# EasyEDA Pro project Laser Monitor.eprj, board Main Board PCB
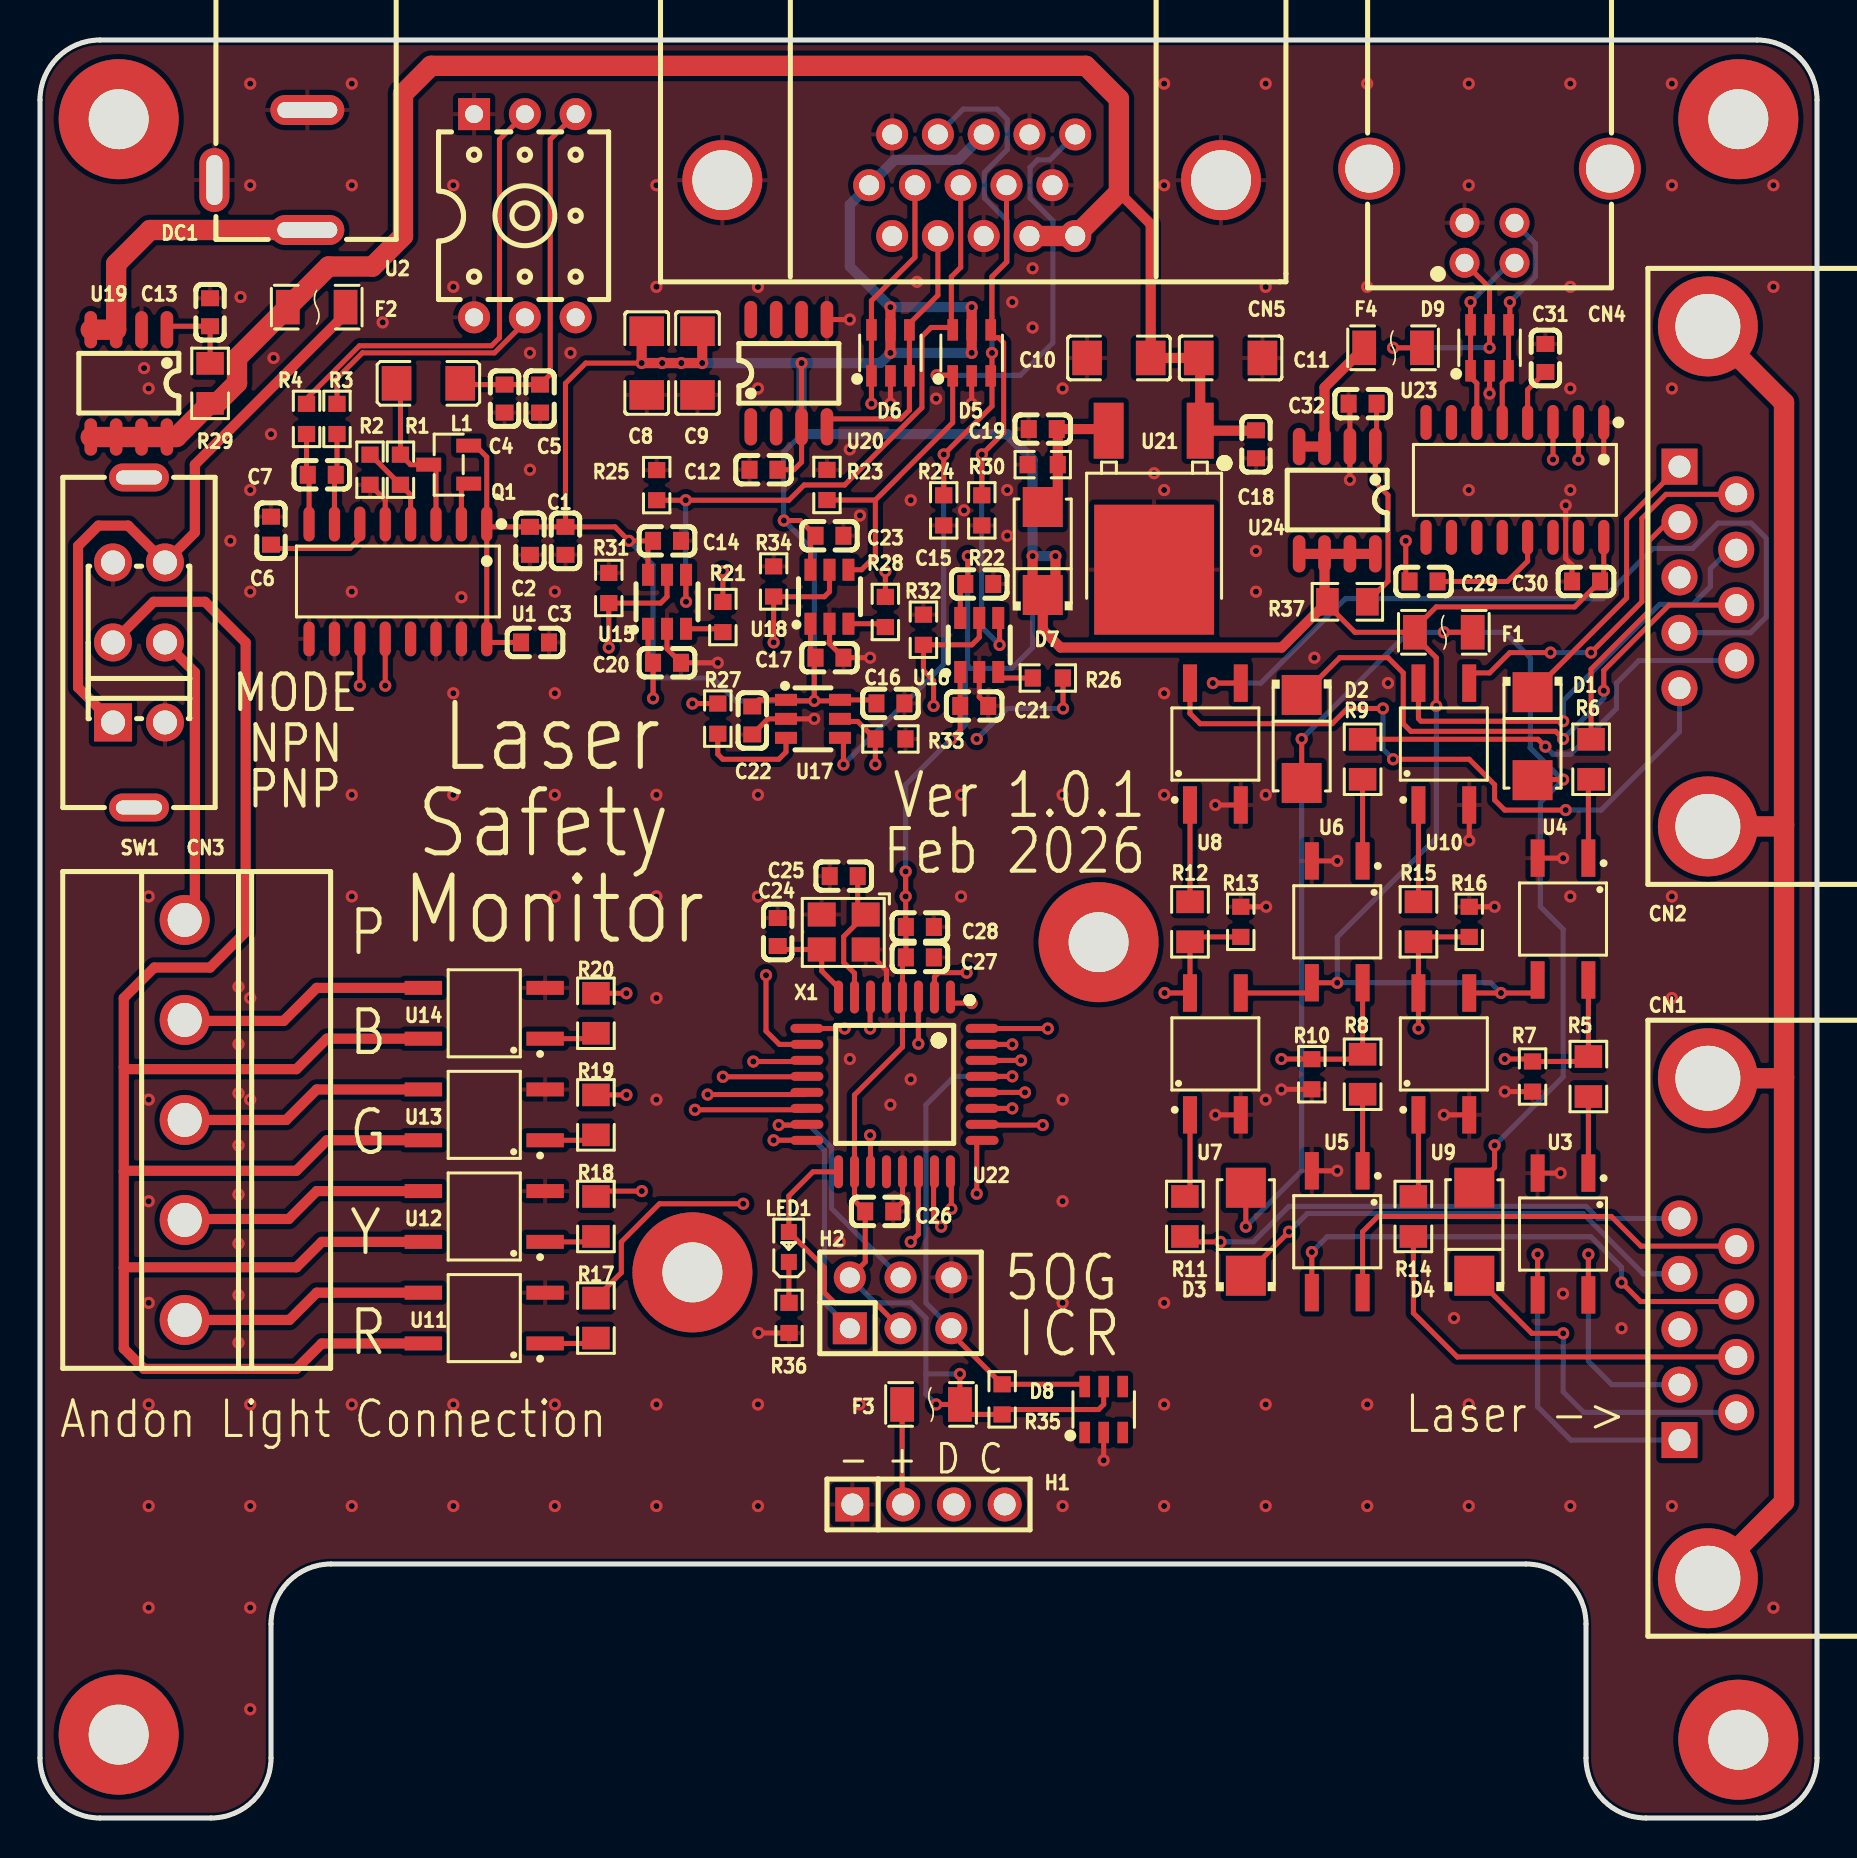
[diagram p6: board, top side]
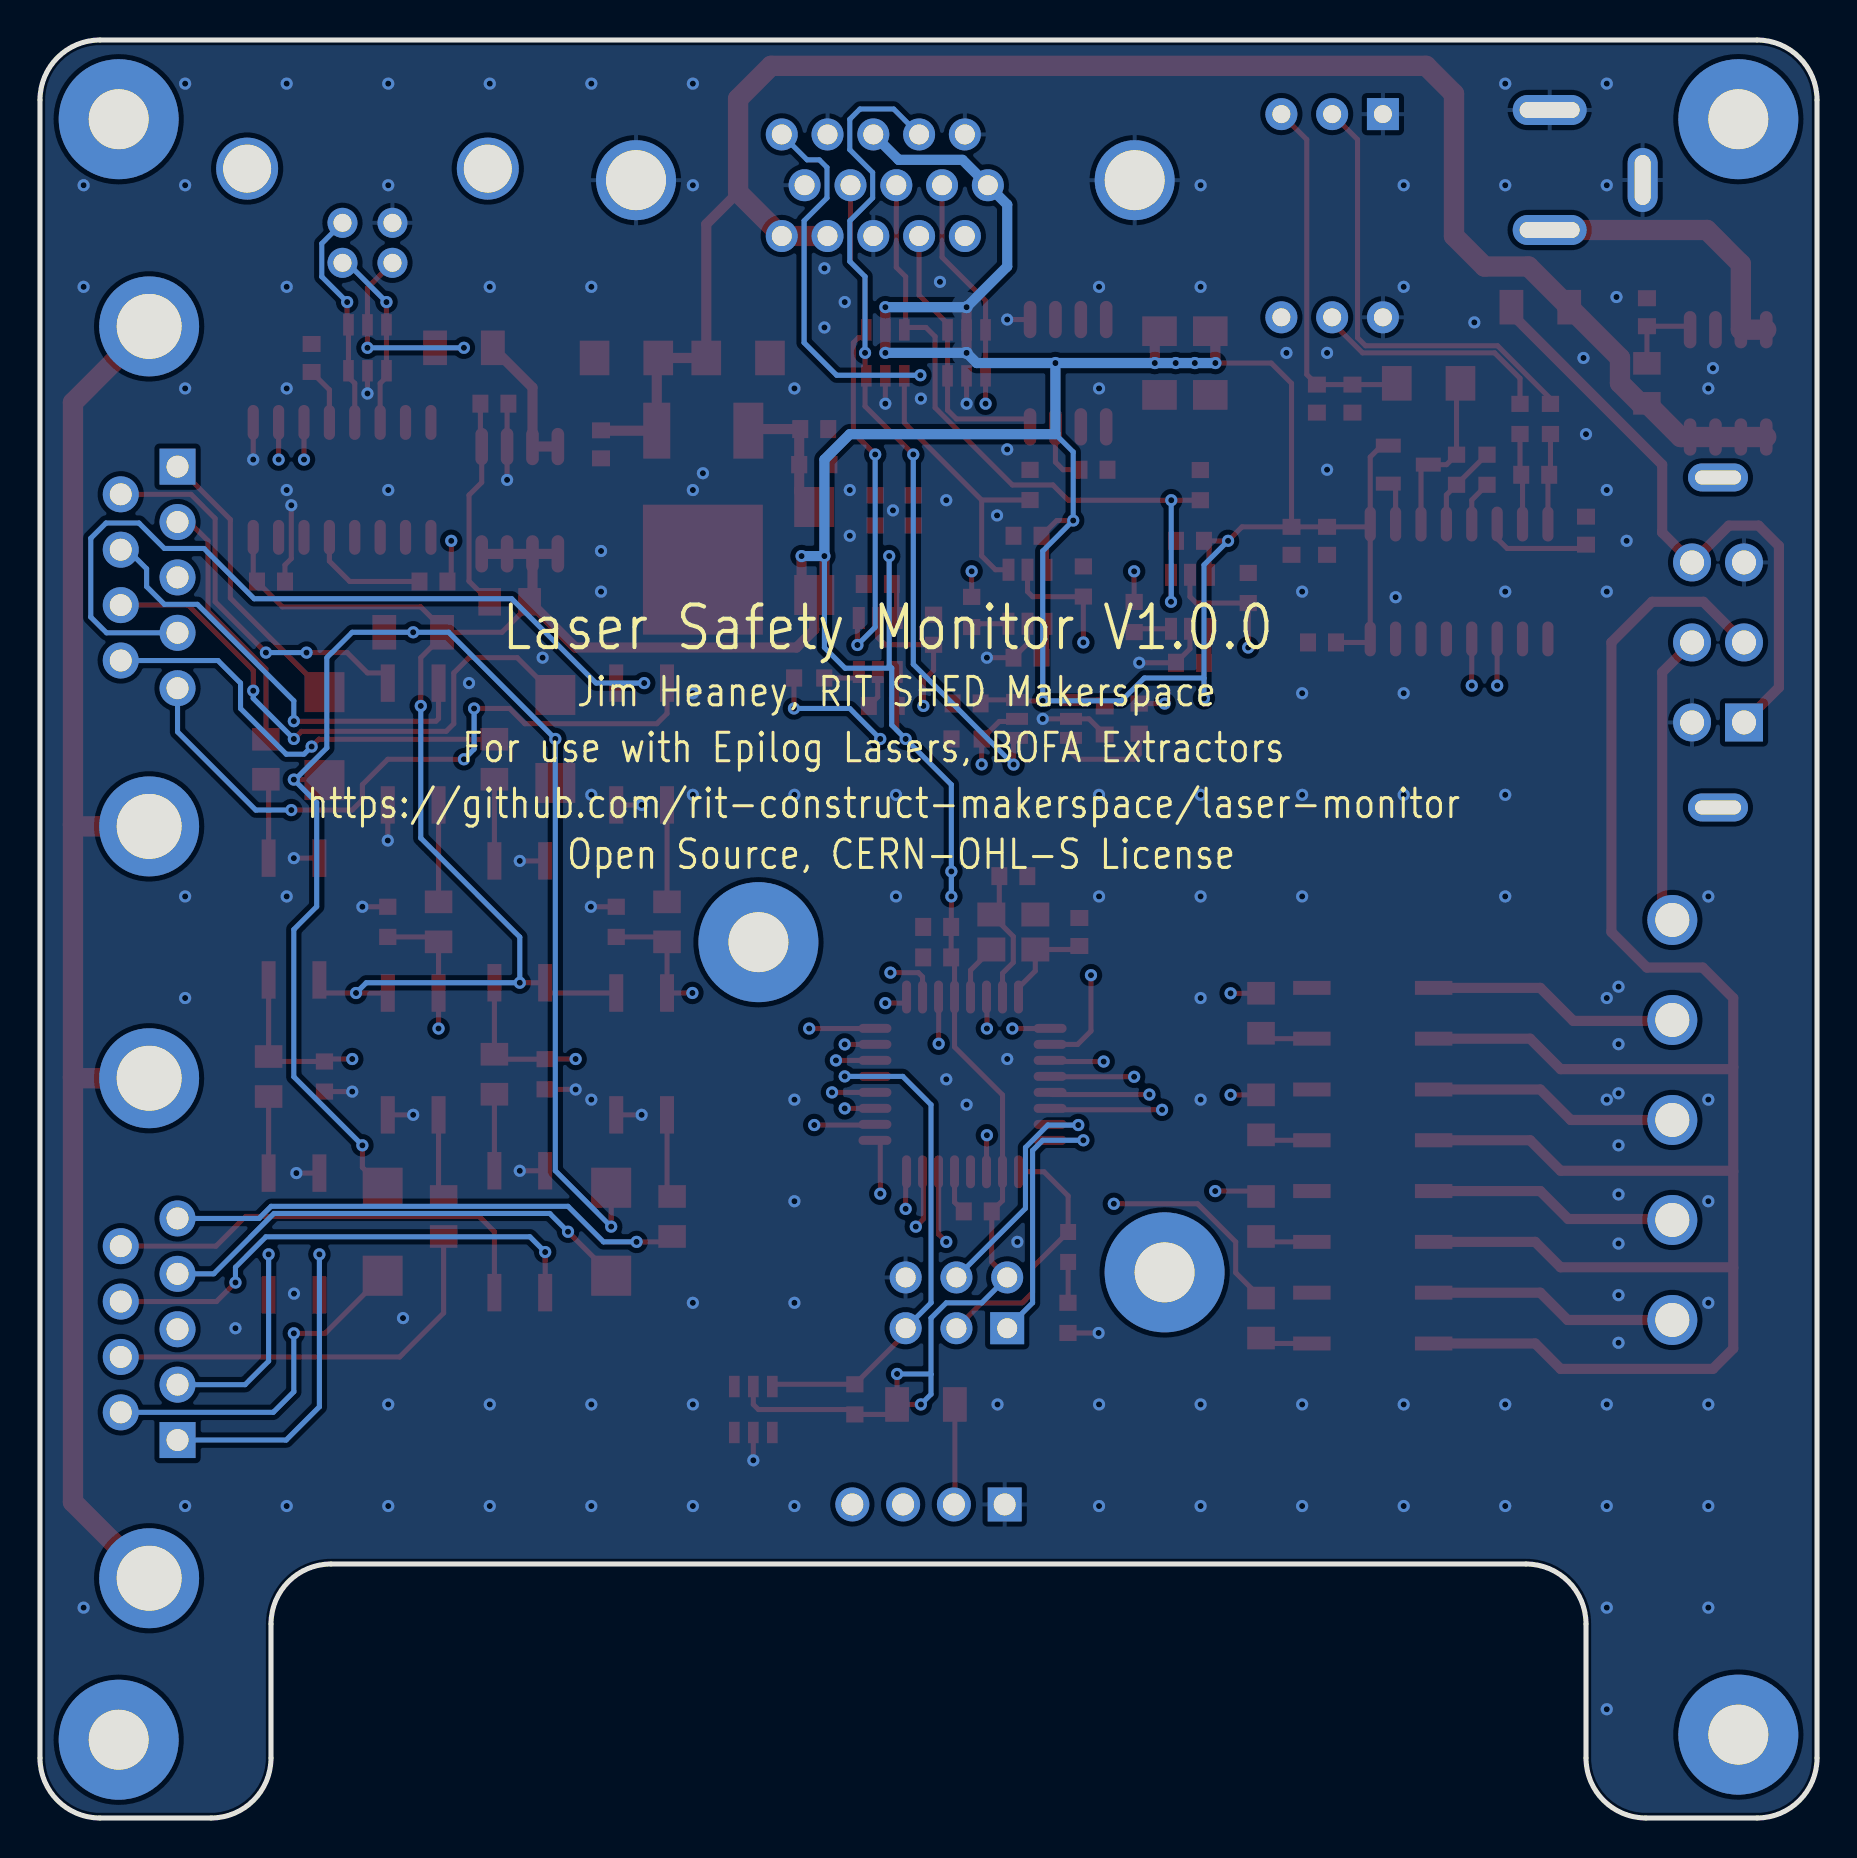
[diagram p7: board, bottom side, seen from below]

Outline 88.9 x 88.9 mm; copper layers: Top Layer, Inner1, Inner2, Bottom Layer. Coordinates in mm from the lower left corner of the outline.
Outline path: 0,85.9 arc(0.88,88.02) 3,88.9 85.9,88.9 arc(88.02,88.02) 88.9,85.9 88.9,3 arc(88.02,0.88) 85.9,0 80.34,0 arc(78.22,0.88) 77.34,3 77.34,9.7 arc(76.46,11.82) 74.34,12.7 14.56,12.7 arc(12.44,11.82) 11.56,9.7 11.56,3 arc(10.68,0.88) 8.56,0 3,0 arc(0.88,0.88) 0,3 0,85.9
Stack: Top Layer 0.035mm Outer layer thickness 1oz / Dielectric1 0.2104mm 7628 RC49% 8.6mil / Inner1 0.0152mm Inner layer thickness / Dielectric2 1.065mm 1.1mm H/HOZ Copper / Inner2 0.0152mm Inner layer thickness / Dielectric3 0.2104mm 7628 RC49% 8.6mil / Bottom Layer 0.035mm Outer layer thickness 1oz

## Design rules (mm)
template: JLCPCB Capability(Two Layers Board)
spacing copperThickness1oz (default): track to track 0.102, other pairs 0.152 to 0.3
spacing copperThickness2oz: track to track 0.203, other pairs 0.152 to 0.3
track width copperThickness1oz (default): min 0.127, default 0.254, max 2.54
track width copperThickness2oz: min 0.203, default 0.254, max 2.54
differential pair differentialPair (default): width min 0.127, default 0.254, max 2.54; gap min 0.152, default 0.152
via viaSize (default): diameter min 0.5, default 0.61, max 10; hole min 0.3, default 0.305, max 6.3

## Placement (name value [footprint] x y rotation side)
C1  10uF  [C0603]  26.29 63.86 90 top
C2  100nF  [C0603]  24.51 63.86 90 top
C3  100nF  [C0603]  24.77 58.78 180 top
C4  100nF  [C0603]  23.24 70.97 90 top
C5  10uF  [C0603]  25.02 70.97 90 top
C6  100nF  [C0603]  11.56 64.37 270 top
C7  100nF  [C0603]  14.1 67.16 0 top
C8  22uF  [C1206]  30.35 72.75 90 top
C9  22uF  [C1206]  32.89 72.75 90 top
C10  22uF  [C1206]  53.98 73 0 top
C11  22uF  [C1206]  59.56 73 180 top
C12  100nF  [C0603]  36.2 67.41 0 top
C13  100nF  [C0603]  8.51 75.29 270 top
C14  100nF  [C0603]  31.37 63.86 180 top
C15  100nF  [C0603]  46.99 61.7 180 top
C16  100nF  [C0603]  42.55 55.73 180 top
C17  100nF  [C0603]  39.5 58.02 180 top
C18  1uF  [C0603]  60.83 68.68 90 top
C19  1uF  [C0603]  50.17 69.45 0 top
C20  100nF  [C0603]  31.37 57.76 180 top
C21  100nF  [C0603]  46.74 55.6 180 top
C22  100nF  [C0603]  35.64 54.88 90 top
C23  100nF  [C0603]  39.5 64.11 180 top
C24  15pF  [C0603]  36.91 44.3 270 top
C25  15pF  [C0603]  40.21 47.09 0 top
C26  100nF  [C0603]  41.99 30.33 180 top
C27  100nF  [C0603]  44.02 43.03 180 top
C28  1uF  [C0603]  44.02 44.55 180 top
C29  100nF  [C0603]  69.21 61.83 0 top
C30  100nF  [C0603]  77.34 61.83 0 top
C31  100nF  [C0603]  75.31 73 270 top
C32  100nF  [C0603]  66.17 70.72 0 top
CN1  DR-9M  [DR9-TH_ZHOUR_DR-9P-R]  83.44 24.49 90 top
CN2  DR-9F  [DR9-TH_ZHOUR_DR-9P-L]  83.44 62.08 90 top
CN3  DB103-5.0-5P-BU-S  [CONN-TH_5P-P5.00_DB103-5.0-5P-BU-S]  7.24 34.9 90 top
CN4  921-111A1010D10200  [USB-B_TH_USB-B-FEMALE-90]  72.52 80.11 180 top
CN5  DS1038-15FBNSiA74-0CC  [DSUB-TH_DS1038-15FBNSIA74-0CC]  46.61 81.64 180 top
D1  SS34  [SMA_L4.3-W2.6-LS5.2-RD]  74.67 54.09 270 top
D2  SS34  [SMA_L4.3-W2.6-LS5.2-RD]  63.12 53.95 270 top
D3  SS34  [SMA_L4.3-W2.6-LS5.2-RD]  60.33 29.31 90 top
D4  SS34  [SMA_L4.3-W2.6-LS5.2-RD]  71.76 29.31 90 top
D5  SRV05-4  [SOT-23-6_L2.9-W1.6-P0.95-LS2.8-BL]  46.61 73.26 0 top
D6  SRV05-4  [SOT-23-6_L2.9-W1.6-P0.95-LS2.8-BL]  42.55 73.26 0 top
D7  SS34  [SMA_L4.3-W2.6-LS5.2-RD]  50.17 63.35 90 top
D8  SRV05-4  [SOT-23-6_L2.9-W1.6-P0.95-LS2.8-BL]  53.21 20.42 0 top
D9  SRV05-4  [SOT-23-6_L2.9-W1.6-P0.95-LS2.8-BL]  72.52 73.51 0 top
DC1  DC-005-A250  [DC-IN-TH_DC-005-A250]  11.05 82.4 270 top
F1  MF-NSMF050-2  [F1206]  70.23 59.29 180 top
F2  MF-NSMF050-2  [F1206]  13.84 75.54 0 top
F3  MF-NSMF050-2  [F1206]  44.58 20.68 0 top
F4  MF-NSMF050-2  [F1206]  67.69 73.51 0 top
H1  -  [HDR-TH_4P-P2.54-V-M]  44.45 15.68 0 top
H2  -  [HDR-TH_6P-P2.54-V-F-R2-C3-S2.54]  43.05 25.76 0 top
L1  10uH  [L1206]  19.43 71.73 180 top
LED1  KT-0603R  [LED0603-RD]  37.46 28.55 90 top
NOREF  -  [Pad_e1474]  32.64 27.28 0 top
NOREF#2  -  [Pad_e123]  84.96 3.91 0 top
NOREF#3  -  [Pad_e121]  84.96 84.94 0 top
NOREF#4  -  [Pad_e124]  3.94 4.17 0 top
NOREF#5  -  [Pad_e1475]  52.96 43.79 0 top
NOREF#6  -  [Pad_e125]  3.94 84.94 0 top
Q1  MMBT4403  [SOT-23-3_L2.9-W1.3-P0.95-LS2.4-BR]  20.45 67.67 0 top
R1  20kΩ  [R0603]  18.03 67.41 90 top
R2  8.2kΩ  [R0603]  16.51 67.41 90 top
R3  100Ω  [R0603]  14.86 69.95 90 top
R4  100Ω  [R0603]  13.34 69.95 90 top
R5  390Ω  [R0805]  77.46 37.07 90 top
R6  390Ω  [R0805]  77.6 52.94 270 top
R7  10kΩ  [R0603]  74.67 37.07 90 top
R8  390Ω  [R0805]  66.17 37.19 90 top
R9  390Ω  [R0805]  66.17 52.94 270 top
R10  10kΩ  [R0603]  63.63 37.19 90 top
R11  390Ω  [R0805]  57.28 30.08 270 top
R12  390Ω  [R0805]  57.53 44.81 270 top
R13  10kΩ  [R0603]  60.07 44.81 270 top
R14  390Ω  [R0805]  68.71 30.08 270 top
R15  390Ω  [R0805]  68.96 44.81 270 top
R16  10kΩ  [R0603]  71.5 44.81 270 top
R17  390Ω  [R0805]  27.81 25 90 top
R18  390Ω  [R0805]  27.81 30.08 90 top
R19  390Ω  [R0805]  27.81 35.16 90 top
R20  390Ω  [R0805]  27.81 40.24 90 top
R21  4.7kΩ  [R0603]  34.16 60.05 90 top
R22  10kΩ  [R0603]  47.12 65.38 270 top
R23  10kΩ  [R0603]  39.37 66.65 90 top
R24  10kΩ  [R0603]  45.21 65.38 270 top
R25  10kΩ  [R0603]  30.85 66.64 90 top
R26  4.7kΩ  [R0603]  50.42 57 0 top
R27  4.7kΩ  [R0603]  33.91 54.97 90 top
R28  4.7kΩ  [R0603]  42.29 60.3 90 top
R29  390Ω  [R0805]  8.51 71.73 270 top
R30  1kΩ  [R0603]  50.17 67.67 0 top
R31  10kΩ  [R0603]  28.46 61.5 90 top
R32  10kΩ  [R0603]  44.2 59.41 90 top
R33  10kΩ  [R0603]  42.55 53.95 0 top
R34  10kΩ  [R0603]  36.7 61.83 90 top
R35  10kΩ  [R0603]  48.13 20.93 270 top
R36  1kΩ  [R0603]  37.47 25 90 top
R37  390Ω  [R0805]  65.41 60.81 180 top
SW1  SS-22F07-G100  [SW-TH_6P-L16.5-W7.5-P4.0-LS2.6-TL]  4.95 58.78 90 top
U1  HX711  [SOP-16_L10.0-W3.9-P1.27-LS6.0-BL]  17.91 61.83 180 top
U2  WF100SPZ 2BG D6 AT  [DIP-6_L8.5-W8.5-P2.54-LS10.2-TL]  24.26 80.11 0 top
U3  AT172-CuH-S  [SOP-4_L4.6-W4.2-P2.54-LS7.1-BL]  76.19 29.2 180 top
U4  AT172-CuH-S  [SOP-4_L4.6-W4.2-P2.54-LS7.1-BL]  76.19 44.95 180 top
U5  AT172-CuH-S  [SOP-4_L4.6-W4.2-P2.54-LS7.1-BL]  64.9 29.31 180 top
U6  AT172-CuH-S  [SOP-4_L4.6-W4.2-P2.54-LS7.1-BL]  64.9 44.81 180 top
U7  AT172-CuH-S  [SOP-4_L4.6-W4.2-P2.54-LS7.1-BL]  58.8 38.2 0 top
U8  AT172-CuH-S  [SOP-4_L4.6-W4.2-P2.54-LS7.1-BL]  58.8 53.7 0 top
U9  AT172-CuH-S  [SOP-4_L4.6-W4.2-P2.54-LS7.1-BL]  70.23 38.2 0 top
U10  AT172-CuH-S  [SOP-4_L4.6-W4.2-P2.54-LS7.1-BL]  70.23 53.7 0 top
U11  AT172-CuH-S  [SOP-4_L4.6-W4.2-P2.54-LS7.1-BL]  22.23 25 90 top
U12  AT172-CuH-S  [SOP-4_L4.6-W4.2-P2.54-LS7.1-BL]  22.23 30.08 90 top
U13  AT172-CuH-S  [SOP-4_L4.6-W4.2-P2.54-LS7.1-BL]  22.23 35.16 90 top
U14  AT172-CuH-S  [SOP-4_L4.6-W4.2-P2.54-LS7.1-BL]  22.23 40.24 90 top
U15  SN74LVC1T45DBVR  [SOT-23-6_L2.9-W1.6-P0.95-LS2.8-BR]  31.37 60.81 270 top
U16  SN74LVC1T45DBVR  [SOT-23-6_L2.9-W1.6-P0.95-LS2.8-BR]  46.99 58.65 270 top
U17  SN74LVC1T45DBVR  [SOT-23-6_L2.9-W1.6-P0.95-LS2.8-BR]  38.67 54.96 180 top
U18  SN74LVC1T45DBVR  [SOT-23-6_L2.9-W1.6-P0.95-LS2.8-BR]  39.5 61.06 270 top
U19  MX5052S  [SOP-8_L4.9-W3.9-P1.27-LS6.0-BL]  4.45 71.73 180 top
U20  DS18B20Z  [SOP-8_L4.9-W3.9-P1.27-LS6.0-BL]  37.46 72.24 0 top
U21  L78M05ABDT-TR  [TO-252-2_L6.5-W6.1-P4.58-LS10.0-TL]  55.75 65.89 270 top
U22  ATMEGA328PB-AU  [TQFP-32_L7.0-W7.0-P0.80-LS9.0-BL]  42.75 36.68 180 top
U23  CH340C  [SOP-16_L10.0-W3.9-P1.27-LS6.0-BL]  73.79 66.91 180 top
U24  MX5052S  [SOP-8_L4.9-W3.9-P1.27-LS6.0-BL]  64.9 65.89 180 top
X1  16MHz  [OSC-SMD_4P-L3.2-W2.5-BL]  40.21 44.3 180 top

## Footprints (pads in the part's own frame, mm; a bottom-side part is the same pattern mirrored in y, then rotated)
C0603
  rect 0.8x0.9 smd: 1(-0.7,0) 2(0.7,0)
C1206
  rect 1.485x1.728 smd: 1(-1.593,0) 2(1.593,0)
CONN-TH_5P-P5.00_DB103-5.0-5P-BU-S
  round 2.5 hole 1.7: 1(-10,0) 2(-5,0) 3(0,0) 4(5,0) 5(10,0)
DC-IN-TH_DC-005-A250
  oval 1.5x3.7 hole 0.8x3: 1(3,2.325) 2(-3,2.325)
  oval 3.2x1.5 hole 2.5x0.8: 3(0.5,-2.325)
DIP-6_L8.5-W8.5-P2.54-LS10.2-TL
  rect 1.6x1.6 hole 0.9: 1(-2.54,5.08)
  round 1.6 hole 0.9: 2(0,5.08) 3(2.54,5.08) 4(2.54,-5.08) 5(0,-5.08) 6(-2.54,-5.08)
DR9-TH_ZHOUR_DR-9P-L
  rect 1.8x1.8 hole 1.1: 1(5.489,1.42)
  round 1.8 hole 1.1: 2(2.719,1.42) 3(-0.051,1.42) 4(-2.821,1.42) 5(-5.59,1.42) 6(4.104,-1.42) 7(1.335,-1.42) 8(-1.435,-1.42) 9(-4.205,-1.42)
  round 5 hole 3.25: 10(-12.5,0) 11(12.5,0)
DR9-TH_ZHOUR_DR-9P-R
  rect 1.8x1.8 hole 1.1: 1(-5.59,1.42)
  round 1.8 hole 1.1: 2(-2.821,1.42) 3(-0.051,1.42) 4(2.72,1.42) 5(5.489,1.42) 6(-4.206,-1.42) 7(-1.435,-1.42) 8(1.334,-1.42) 9(4.104,-1.42)
  round 5 hole 3.25: 10(-12.5,0) 11(12.5,0)
DSUB-TH_DS1038-15FBNSIA74-0CC
  round 1.6 hole 1: 1(3.978,2.54) 2(1.688,2.54) 3(-0.603,2.54) 4(-2.893,2.54) 5(-5.182,2.54) 6(5.128,0) 7(2.837,0) 8(0.548,0) 9(-1.743,0) 10(-4.042,0) 11(3.978,-2.54) 12(1.688,-2.54) 13(-0.603,-2.54) 14(-2.893,-2.54) 15(-5.182,-2.54)
  round 4 hole 3: 16(12.473,-0.254) 17(-12.473,-0.254)
F1206
  rect 1.19x1.728 smd: 1(-1.445,0) 2(1.445,0)
HDR-TH_4P-P2.54-V-M
  rect 1.7x1.7 hole 1.1: 1(-3.81,0)
  round 1.7 hole 1.1: 2(-1.27,0) 3(1.27,0) 4(3.81,0)
HDR-TH_6P-P2.54-V-F-R2-C3-S2.54
  rect 1.7x1.6 hole 1: 1(-2.54,-1.27)
  round 1.6 hole 1: 2(-2.54,1.27) 3(0,-1.27) 4(0,1.27) 5(2.54,-1.27) 6(2.54,1.27)
L1206
  rect 1.485x1.728 smd: 1(-1.593,0) 2(1.593,0)
LED0603-RD
  rect 0.8x0.8 smd: 1(-0.749,0) 2(0.749,0)
OSC-SMD_4P-L3.2-W2.5-BL
  rect 1.4x1.2 smd: 1(-1.1,-0.875) 2(1.1,-0.875) 3(1.1,0.875) 4(-1.1,0.875)
Pad_e121
  round 6 hole 3: 1(0,0)
Pad_e123
  round 6 hole 3: 1(0,0)
Pad_e124
  round 6 hole 3: 1(0,0)
Pad_e125
  round 6 hole 3: 1(0,0)
Pad_e1474
  round 6 hole 3: 1(0,0)
Pad_e1475
  round 6 hole 3: 1(0,0)
R0603
  rect 0.806x0.864 smd: 1(-0.753,0) 2(0.753,0)
R0805
  rect 1.133x1.377 smd: 1(-1,0) 2(1,0)
SMA_L4.3-W2.6-LS5.2-RD
  rect 2x2 smd: 1(-2.2,0) 2(2.2,0)
SOP-4_L4.6-W4.2-P2.54-LS7.1-BL
  rect 0.7x1.872 smd: 1(-1.27,-3.046) 2(1.27,-3.046) 3(1.27,3.046) 4(-1.27,3.046)
SOP-8_L4.9-W3.9-P1.27-LS6.0-BL
  oval 0.63x1.865 smd: 1(-1.905,-2.683) 2(-0.635,-2.683) 3(0.635,-2.683) 4(1.905,-2.683) 5(1.905,2.683) 6(0.635,2.683) 7(-0.635,2.683) 8(-1.905,2.683)
SOP-16_L10.0-W3.9-P1.27-LS6.0-BL
  oval 0.56x1.745 smd: 1(-4.445,-2.873) 2(-3.175,-2.873) 3(-1.905,-2.873) 4(-0.635,-2.873) 5(0.635,-2.873) 6(1.905,-2.873) 7(3.175,-2.873) 8(4.445,-2.873) 9(4.445,2.873) 10(3.175,2.873) 11(1.905,2.873) 12(0.635,2.873) 13(-0.635,2.873) 14(-1.905,2.873) 15(-3.175,2.873) 16(-4.445,2.873)
SOT-23-3_L2.9-W1.3-P0.95-LS2.4-BR
  rect 1.25x0.7 smd: 1(1,-0.95) 2(1,0.95) 3(-1,0)
SOT-23-6_L2.9-W1.6-P0.95-LS2.8-BL
  rect 0.532x1.072 smd: 1(-0.95,-1.149) 2(0,-1.149) 3(0.95,-1.149) 4(0.95,1.149) 5(0,1.149) 6(-0.95,1.149)
SOT-23-6_L2.9-W1.6-P0.95-LS2.8-BR
  rect 1.1x0.6 smd: 1(1.35,-0.95) 2(1.35,0) 3(1.35,0.95) 4(-1.35,0.95) 5(-1.35,0) 6(-1.35,-0.95)
SW-TH_6P-L16.5-W7.5-P4.0-LS2.6-TL
  rect 1.9x1.9 hole 1.2: 1(-4,1.3)
  round 1.9 hole 1.2: 2(0,1.3) 3(4,1.3) 4(-4,-1.3) 5(0,-1.3) 6(4,-1.3)
  oval 1.4x3 hole 0.7x2.3: 7(-8.25,0) 8(8.25,0)
TO-252-2_L6.5-W6.1-P4.58-LS10.0-TL
  rect 2.8x1.35 smd: 1(-3.475,2.29)
  rect 2.8x1.5 smd: 3(-3.475,-2.29)
  rect 6.5x6 smd: 4(3.475,-0.017)
TQFP-32_L7.0-W7.0-P0.80-LS9.0-BL
  oval 0.45x1.65 smd: 1(-2.8,-4.369) 2(-2,-4.369) 3(-1.2,-4.369) 4(-0.4,-4.369) 5(0.4,-4.369) 6(1.2,-4.369) 7(2,-4.369) 8(2.8,-4.369) 17(2.8,4.369) 18(2,4.369) 19(1.2,4.369) 20(0.4,4.369) 21(-0.4,4.369) 22(-1.2,4.369) 23(-2,4.369) 24(-2.8,4.369)
  oval 1.65x0.45 smd: 9(4.381,-2.8) 10(4.381,-2) 11(4.381,-1.2) 12(4.381,-0.4) 13(4.381,0.4) 14(4.381,1.2) 15(4.381,2) 16(4.381,2.8) 25(-4.381,2.8) 26(-4.381,2) 27(-4.381,1.2) 28(-4.381,0.4) 29(-4.381,-0.4) 30(-4.381,-1.2) 31(-4.381,-2) 32(-4.381,-2.8)
USB-B_TH_USB-B-FEMALE-90
  round 1.5 hole 0.9: 1(1.25,2.355) 2(-1.25,2.355) 3(-1.25,0.355) 4(1.25,0.355)
  round 3.1 hole 2.4: 5(-6.02,-2.355) 6(6.02,-2.355)

## Nets
As in the schematic.

Pads without a net: CN1 3; CN2 3; CN4 5 6; CN5 1; D8 1 3 4; NOREF 1; NOREF#2 1; NOREF#3 1; NOREF#4 1; NOREF#5 1; NOREF#6 1; SW1 7 8; U1 13; U2 4; U20 1 2 6 7 8; U22 20; U23 7 8 9 10 11 12 14 15

## Via types
v1: diameter 0.61, hole 0.305, Top Layer to Bottom Layer, 268 vias

## Routing (per net, layer and track width the routed paths; a pad name or vN(x,y) marks a point on that pad's centre or on a via; arc(x,y) is an arc through that point)
+5V: length 317.7
  Top Layer w0.254: v1(43.31,47.33) v1(43.31,46.08) 43.31,44.56 C28.2 C27.2 43.15,42.86 U22.4 43.15,38.55 40.75,36.15 U22.18 40.75,30.87 C26.2 41.29,27.8 H2.2 ; v1(44.83,20.68) F3.2 ; F3.2 46.52,20.18 R35.2 48.38,20.42 52.96,20.42 53.21,20.68 D8.5 ; F3.2 v1(46.02,22.2) ; v1(38.73,55.86) 37.37,55.86 U17.1 35.97,55.91 C22.2 ; v1(38.73,55.86) 38.73,57.95 C17.2 38.55,58.27 U18.1 ; v1(38.73,55.86) 39.97,55.86 U17.6 41.67,55.91 C16.2 ; C1.2 C2.2 22.49,64.56 22.35,64.7 ; C1.2 26.29,71.73 27.3,72.75 v1(30.1,72.75) ; C1.2 28.76,64.56 v1(29.46,63.86) C14.2 ; F1.2 68.79,59.08 69.85,58.02 v1(69.85,55.6) ; F1.2 68.79,59.49 69.85,60.56 76.77,60.56 C30.2 78.23,62.02 78.23,64.03 ; F1.2 65.79,59.29 64.41,60.67 R37.2 ; v1(46.42,63.1) 46.42,61.83 C15.2 46.04,61.45 U16.6 ; U9.3 v1(73.09,41.25) 74.92,41.25 U4.3 ; 22.35,64.7 22.35,68.05 21.78,68.62 Q1.2 ; 22.35,64.7 22.35,58.95 22.53,58.78 C3.2 ; U7.3 63.63,41.25 U6.3 v1(64.9,41.76) ; C12.2 37.72,67.41 38.1,67.8 v1(38.1,72.75) ; 30.75,63.84 30.42,63.51 U15.6 ; v1(30.67,55.98) C20.2 30.42,58.01 U15.1 ; v1(45.59,53.95) 46.04,54.4 C21.2 46.04,57.3 U16.1 ; U18.6 38.55,63.86 C23.2 38.04,64.87 v1(37.21,64.87)
  Top Layer w0.508: U24.5 U24.6 ; U24.6 U24.7 U24.8 ; U24.6 64.26,60.95 R37.2 62.12,58.52 51.05,58.52 50.17,59.41 D7.1 ; v1(42.55,73.26) D6.5 v1(42.55,75.54) ; D7.1 50.8,61.79 v1(50.8,63.1) ; D7.1 49.66,61.66 v1(49.66,63.1) ; C8.2 30.1,74.09 v1(30.1,72.75) v1(31.13,72.75) v1(32.08,72.75) v1(33.13,72.75) 33.13,74.11 C9.2 ; v1(46.61,73.26) D5.5 v1(46.61,75.54)
  Bottom Layer w0.254: 46.29,57.49 48.62,57.49 49.66,58.52 v1(49.66,63.1) ; 46.29,57.49 46.42,57.62 v1(46.42,63.1) ; 46.29,57.49 46.29,54.65 v1(45.59,53.95) 43.31,51.67 v1(43.31,47.33) v1(43.31,46.08) ; v1(30.67,55.98) 30.67,56.98 ; 30.67,56.98 30.69,57 33.66,57 34.8,55.86 v1(38.73,55.86) 38.73,63.35 v1(37.21,64.87) 37.21,68.3 38.1,69.19 ; 30.67,56.98 30.67,62.65 v1(29.46,63.86) ; v1(69.85,55.6) 69.85,49 64.9,44.05 v1(64.9,41.76) 72.58,41.76 v1(73.09,41.25) ; 44.32,22.19 44.32,25 43.56,25.76 41.78,25.76 H2.2 ; 44.32,22.19 44.34,22.2 v1(46.02,22.2) ; 44.32,22.19 44.32,21.19 v1(44.83,20.68)
  Bottom Layer w0.508: v1(38.1,72.75) 42.04,72.75 v1(42.55,73.26) v1(46.61,73.26) ; v1(38.1,72.75) v1(33.13,72.75) v1(32.08,72.75) v1(31.13,72.75) v1(30.1,72.75) ; v1(38.1,72.75) 38.1,69.19 48.39,69.19 49.66,67.92 v1(49.66,63.1) v1(50.8,63.1) ; CN5.13 45.94,82.91 42.75,82.91 CN5.6 40.51,80.67 40.51,77.57 v1(42.55,75.54) v1(46.61,75.54)
+12V: length 92.6
  Top Layer w0.508: 53.98,81.28 55.57,79.69 C10.2 C11.2 58.04,72.93 U21.1 60.81,69.37 C18.2
  Top Layer w1.016: U19.5 U19.6 U19.7 U19.8 6.83,69.05 R29.2 8.84,70.73 9.86,71.75 9.86,73 14.43,77.57 16.64,77.57 18.16,79.1 18.16,86.21 19.56,87.61 52.32,87.61 53.98,85.96 53.98,81.28 CN5.5 CN5.4
GND: length 53.3
  Top Layer w0.254: D5.2 v1(46.61,70.72) ; v1(41.53,58.02) C17.1 39.5,58.72 U18.2 ; U7.2 v1(58.8,35.16) ; U8.2 v1(58.8,50.65) ; v1(33.91,57.76) C20.1 31.37,58.46 U15.2 ; C22.1 36.42,54.96 U17.2 v1(38.73,54.96) ; R7.1 v1(73.28,36.32) ; D6.2 v1(42.55,70.72) ; U10.2 v1(71.5,48.87) ; U9.2 v1(70.23,35.16) ; 78.23,69.78 v1(78.23,67.92) ; C32.1 65.53,70.65 U24.2 v1(65.53,66.91) ; U16.2 46.99,56.05 C21.1 ; R10.1 62.11,36.43 v1(62.1,36.43) ; 74.92,47.99 v1(76.2,47.99) ; R13.1 v1(61.34,45.56) ; 37.47,24.25 v1(35.94,24.25) ; U20.5 v1(40.51,74.92) ; R2.1 17.27,65.9 17.27,64.7 ; U22.5 42.35,42.39 X1.4 ; C30.1 76.64,62.65 76.33,62.97 v1(76.33,65.64) ; U3.2 v1(76.07,32.25) ; U6.2 v1(64.9,47.85) ; C26.1 43.15,30.79 U22.21 ; D9.2 v1(72.52,71.22) ; U5.2 v1(64.9,32.36) ; D8.2 v1(53.21,17.88) ; R16.1 v1(72.77,45.56)
  vias: v1(5.21,72.49) v1(5.44,71.48) v1(5.44,46.08) v1(5.44,35.92) v1(5.44,30.84) v1(5.44,25.76) v1(5.44,20.68) v1(5.44,15.6) v1(5.44,10.52) v1(9.53,63.86) v1(9.93,41.56) v1(9.93,38.69) v1(9.93,36.24) v1(9.93,33.63) v1(9.93,31.18) v1(9.93,28.72) v1(9.93,26.14) v1(9.93,23.76) v1(10.03,76.05) v1(10.52,86.72) v1(10.52,81.64) v1(10.52,66.4) v1(10.52,61.32) v1(10.52,41) v1(10.52,35.92) v1(10.52,20.68) v1(10.52,15.6) v1(10.52,10.52) v1(10.52,5.44) v1(11.56,69.19) v1(11.68,73) v1(15.6,86.72) v1(15.6,81.64) v1(15.6,61.32) v1(15.6,51.16) v1(15.6,46.08) v1(15.6,20.68) v1(15.6,15.6) v1(17.14,74.78) v1(20.68,81.64) v1(20.68,76.56) v1(20.68,56.24) v1(20.68,51.16) v1(20.68,20.68) v1(20.68,15.6) v1(21.08,61.04) v1(24.51,73.26) v1(24.51,67.41) v1(25.76,61.32) v1(25.76,56.24) v1(25.76,51.16) v1(25.76,46.08) v1(25.76,20.68) v1(25.76,15.6) v1(26.54,73.26) v1(30.84,81.64) v1(30.84,76.56) v1(30.84,51.16) v1(30.84,46.08) v1(30.84,41) v1(30.84,35.92) v1(30.84,20.68) v1(30.84,15.6) v1(35.92,76.56) v1(35.92,71.48) v1(35.92,51.16) v1(35.92,46.08) v1(35.92,20.68) v1(35.92,15.6) v1(40.01,28.81) v1(40.51,68.43) v1(40.51,37.95) v1(41.02,65.13) v1(41,20.68) v1(42.55,35.66) v1(43.56,65.89) v1(43.56,36.93) v1(43.88,76.81) v1(44.83,70.97) v1(46.08,51.16) v1(46.08,46.08) v1(46.23,65.38) v1(48.39,66.4) v1(48.39,64.11) v1(48.64,75.8) v1(49.66,77.49) v1(49.66,74.53) v1(51.16,71.48) v1(51.16,51.16) v1(51.16,35.92) v1(51.16,30.84) v1(51.16,25.76) v1(51.16,15.6) v1(55.74,67.24) v1(56.24,86.72) v1(56.24,81.64) v1(56.24,66.4) v1(56.24,56.24) v1(56.24,51.16) v1(56.24,25.76) v1(56.24,20.68) v1(56.24,15.6) v1(60.83,63.35) v1(60.83,61.32) v1(61.32,86.72) v1(61.32,76.56) v1(61.32,51.16) v1(61.32,35.92) v1(61.32,20.68) v1(61.32,15.6) v1(63.75,58.02) v1(66.4,86.72) v1(66.4,76.56) v1(66.4,20.68) v1(66.4,15.6) v1(67.44,56.75) v1(70.74,25) v1(71.48,86.72) v1(71.48,81.64) v1(71.48,66.4) v1(71.48,20.68) v1(71.48,15.6) v1(76.19,26.22) v1(76.56,86.72) v1(76.56,76.56) v1(76.56,71.48) v1(76.56,66.4) v1(76.56,46.08) v1(76.56,15.6) v1(79.12,24.49) v1(81.64,86.72) v1(81.64,81.64) v1(81.64,71.48) v1(81.64,46.08) v1(81.64,41) v1(81.64,15.6) v1(86.72,81.64) v1(86.72,76.56) v1(86.72,10.52)
VDDA: length 18.3
  Top Layer w0.254: U2.3 25.53,83.92 25.53,72.18 C5.2 C4.2 21.09,71.67 L1.1
BUSIO1: length 34.3
  Top Layer w0.254: R25.1 v1(32.31,65.89) 37.46,65.89 38.23,66.65 40.25,66.65 44.12,70.52 44.12,74.07 44.58,74.53 45.54,74.53 45.59,74.47 ; 45.59,74.47 45.59,77.07 46.06,77.53 CN5.8 ; 45.59,74.47 D5.6 ; U15.4 v1(32.32,60.81)
  Bottom Layer w0.254: v1(32.32,60.81) 32.31,60.82 v1(32.31,65.89)
BUSIO2: length 28
  Top Layer w0.254: 47.94,60 48.01,59.94 v1(48.01,58.65) ; 47.63,74.41 47.63,74.02 47.95,74.02 48.21,73.76 48.21,69.27 v1(47.12,68.18) R22.1 ; 47.63,74.41 47.63,77.07 48.35,77.79 CN5.9 ; 47.63,74.41 D5.4
  Bottom Layer w0.254: v1(48.01,58.65) 47.12,59.54 v1(47.12,68.18)
BUSIO3: length 44.3
  Top Layer w0.254: 40.02,54.01 40.19,53.83 v1(40.19,52.67) ; R24.1 v1(45.21,68.18) 47.63,70.59 47.63,72.04 D5.3 47.63,72.17 v1(47.63,73.26)
  Bottom Layer w0.254: v1(40.19,52.67) 45.21,57.69 v1(45.21,68.18) ; v1(47.63,73.26) 47.63,77.07 48.39,77.83 48.39,79.86 47.24,81 47.24,82.27 48.39,83.42 48.39,84.94 47.88,85.45 46.19,85.45 CN5.12
BUSIO4: length 34.1
  Top Layer w0.254: R23.1 41.79,65.9 ; 41.79,65.9 45.66,69.77 D5.1 45.63,72.14 v1(44.86,72.14) ; 41.79,65.9 41.79,63.1 41.1,62.41 U18.4
  Bottom Layer w0.254: CN5.15 50.52,82.91 49.91,82.91 49.53,82.53 49.53,81 50.67,79.86 50.67,73.76 49.05,72.14 v1(44.86,72.14)
BUZZER: length 12.7
  Top Layer w0.508: 7.24,40.14 7.53,39.86 12.19,39.86 13.84,41.51 U14.3
CTRL-BUZZER: length 30.4
  Top Layer w0.254: U22.25 46.86,33.88 v1(46.86,31.21) ; R20.2 v1(29.34,41.24)
  Inner2 w0.254: v1(46.86,31.21) 42.67,31.21 41.82,32.06 31.16,32.06 29.97,33.25 29.97,40.6 v1(29.34,41.24)
CTRL-GREEN: length 23.6
  Top Layer w0.254: v1(45.59,30.46) 45.59,32.27 U22.24 ; R19.2 v1(29.34,36.16)
  Inner2 w0.254: v1(45.59,30.46) 42.92,30.46 41.68,31.7 31.01,31.7 29.34,33.38 v1(29.34,36.16)
CTRL-RED: length 23.1
  Top Layer w0.254: U22.22 43.94,32.31 43.94,29.19 v1(43.56,28.81) ; R17.2 29.08,27.27 29.08,28.81 30.99,30.71 v1(35.18,30.71)
  Inner2 w0.254: v1(43.56,28.81) 41.66,30.71 v1(35.18,30.71)
CTRL-YELLOW: length 21
  Top Layer w0.254: U22.23 44.7,32.27 44.7,29.95 v1(45.08,29.57) ; R18.2 28.08,31.35 v1(30.11,31.35)
  Inner2 w0.254: v1(30.11,31.35) 41.53,31.35 43.31,29.57 v1(45.08,29.57)
CUSTOMIN+: length 17.6
  Top Layer w0.254: D4.1 74.64,24.23 v1(76.2,24.23)
  Bottom Layer w0.254: CN1.6 77.23,20.28 76.2,21.31 v1(76.2,24.23)
CUSTOMIN-: length 20.9
  Top Layer w0.254: CN1.7 70.9,23.05 68.71,25.25 R14.2
CUSTOMOUT+: length 20
  Top Layer w0.254: v1(77.6,58.27) 80.14,60.81 80.14,64.98 81.35,66.18 CN2.6 ; v1(75.57,58.27) 73.53,58.27 72.52,57.25 71.5,57.25 U10.3
  Bottom Layer w0.254: v1(77.6,58.27) v1(75.57,58.27)
CUSTOMOUT-: length 22.4
  Top Layer w0.254: U10.4 68.96,54.97 69.09,54.84 v1(76.2,54.84)
  Bottom Layer w0.254: CN2.7 84.52,63.41 83.57,62.46 83.57,61.57 82.68,60.68 81.03,60.68 76.2,55.86 v1(76.2,54.84)
CUSTOMREAD: length 31.6
  Top Layer w0.254: v1(46.61,40.74) 45.55,40.74 U22.1 ; v1(68.96,39.47) U9.4 R15.2 69.21,44.05 R16.2
  Inner1 w0.254: v1(46.61,40.74) 47.12,40.24 50.67,40.24 51.08,39.83 55.65,39.83 56.41,39.07 68.55,39.07 v1(68.96,39.47)
D+: length 11.1
  Top Layer w0.254: v1(73.53,75.8) 73.53,74.73 D9.4 D9.3 73.47,72.05 73.15,71.73 U23.5
  Bottom Layer w0.254: CN4.3 74.8,78.72 74.8,77.07 v1(73.53,75.8)
D-: length 9.2
  Top Layer w0.254: U23.6 71.88,71.73 71.57,72.05 D9.1 D9.6 v1(71.57,75.8)
  Bottom Layer w0.254: v1(71.57,75.8) 73.53,77.76 CN4.2
ERRIN+: length 14.3
  Top Layer w0.254: CN2.1 79.38,64.93 79.38,61 D1.1
ERRIN-: length 13.1
  Top Layer w0.254: CN2.2 81.43,64.8 80.49,63.86 80.49,60.34 77.6,57.44 R6.1 77.61,53.95
ERROUT+: length 17.4
  Top Layer w0.254: U3.3 v1(74.92,28.18)
  Bottom Layer w0.254: CN1.1 76.58,18.9 74.92,20.56 v1(74.92,28.18)
ERROUT-: length 12.4
  Top Layer w0.254: U3.4 v1(77.46,28.18)
  Bottom Layer w0.254: CN1.2 78.64,21.67 77.46,22.85 v1(77.46,28.18)
ERRREAD: length 34.9
  Top Layer w0.254: v1(50.42,39.47) 47.14,39.47 U22.32 ; U4.4 R5.2 77.21,37.83 R7.2 74.54,37.95 v1(73.28,37.95)
  Inner1 w0.254: v1(50.42,39.47) 55.5,39.47 56.26,38.71 72.52,38.71 v1(73.28,37.95)
GPIO1: length 47.3
  Top Layer w0.254: U22.15 38.33,34.65 v1(36.96,34.65) ; R21.2 v1(34.16,62.33)
  Inner2 w0.254: v1(36.96,34.65) 34.92,36.68 34.92,39.72 28.81,45.83 28.81,55.97 34.16,61.32 v1(34.16,62.33)
  Bottom Layer w0.254: v1(36.96,34.65) 38.48,34.65 39.6,33.53 39.6,30.48 H2.4
GPIO2: length 49.1
  Top Layer w0.254: v1(36.7,33.89) 38.36,33.89 U22.16 ; v1(51.18,55.48) 51.18,56.99 R26.2
  Inner2 w0.254: v1(36.7,33.89) 37.46,33.12 42.55,33.12 45.06,35.64 45.06,52.15 v1(46.86,53.95)
  Bottom Layer w0.254: v1(36.7,33.89) 38.73,33.89 39.24,33.38 39.24,25.76 H2.1 ; v1(51.18,55.48) 48.39,55.48 v1(46.86,53.95)
GPIO3: length 29.4
  Top Layer w0.254: U22.3 43.94,41.04 v1(43.94,38.71) ; R27.2 v1(32.64,55.72)
  Inner2 w0.254: v1(43.94,38.71) 36.94,38.71 32.64,43.01 v1(32.64,55.72)
GPIO4: length 29.5
  Top Layer w0.254: U22.9 38.37,39.47 v1(40.26,39.47) ; R28.2 v1(42.29,62.33)
  Inner2 w0.254: v1(42.29,62.33) 42.29,61.06 37.06,55.83 37.06,43.44 40.26,40.24 v1(40.26,39.47)
GREEN: length 12.6
  Top Layer w0.508: 7.24,35.06 7.4,34.9 12.32,34.9 13.84,36.43 U13.3
INTERRUPT: length 55.3
  Top Layer w0.254: v1(35.69,37.82) 38.31,37.82 U22.11 ; CN5.7 43.77,78.04 41.6,75.86 D6.6 D6.1 v1(41.6,70.72)
  Inner2 w0.254: v1(41.6,70.72) 34.92,64.05 34.92,61.58 29.17,55.82 29.17,45.98 35.69,39.46 v1(35.69,37.82)
IODIR1: length 34.4
  Top Layer w0.254: v1(28.46,58.52) R31.1 31.05,60.75 31.37,61.06 U15.5 ; U22.12 38.35,37.06 v1(34.16,37.06)
  Inner2 w0.254: v1(28.46,58.52) 28.46,45.69 34.16,39.98 v1(34.16,37.06)
IODIR2: length 32.7
  Top Layer w0.254: U22.19 41.55,34.12 v1(41.53,34.14) ; v1(44.7,55.6) 44.7,56.87 44.2,57.38 R32.1 46.62,58.66 46.99,59.03 U16.5
  Inner2 w0.254: v1(41.53,34.14) 43.06,34.14 44.7,35.79 v1(44.7,55.6)
IODIR3: length 21.8
  Top Layer w0.254: v1(41.79,52.68) R33.1 41.78,53.95 40.91,54.83 40.13,54.83 40.02,54.94 U17.5 ; v1(41.53,39.47) 41.53,41.03 U22.6 41.56,41.04
  Inner2 w0.254: v1(41.53,39.47) 37.42,43.59 37.42,48.31 v1(41.79,52.68)
IODIR4: length 28.2
  Top Layer w0.254: v1(36.7,58.78) R34.1 36.71,61.06 39.24,61.06 39.5,61.32 U18.5 ; v1(36.32,42.14) 36.32,39.35 36.99,38.68 U22.10
  Inner2 w0.254: v1(36.7,58.78) 36.7,42.52 v1(36.32,42.14)
LPIN+: length 29.3
  Top Layer w0.254: v1(78.23,56.37) 78.23,57.38 81.5,60.64 CN2.8 ; v1(76.2,53.95) 75.82,54.33 68.58,54.33 68.2,54.71 68.2,57.25 67.44,58.02 65.02,58.02 63.16,56.15 D2.1
  Bottom Layer w0.254: v1(78.23,56.37) 78.23,55.98 v1(76.2,53.95)
LPIN-: length 21.7
  Top Layer w0.254: v1(75.31,53.57) 74.95,53.94 R9.1
  Bottom Layer w0.254: CN2.9 80,57.87 78.87,56.75 78.87,55.48 76.58,53.19 75.69,53.19 v1(75.31,53.57)
LPOUT+: length 25.4
  Top Layer w0.254: U5.3 v1(63.63,28.3) ; CN1.8 80.07,25.82 v1(79.12,26.77)
  Bottom Layer w0.254: v1(79.12,26.77) 79.12,27.54 77.6,29.06 64.39,29.06 v1(63.63,28.3)
LPOUT-: length 22.7
  Top Layer w0.254: CN1.9 80.1,28.59 78.61,30.08 66.93,30.08 66.17,29.31 U5.4
LPREAD: length 24.4
  Top Layer w0.254: U22.26 47.16,34.65 v1(50.17,34.65) ; U6.4 R8.2 65.92,37.94 R10.2 63.62,37.95 v1(62.1,37.95)
  Inner1 w0.254: v1(50.17,34.65) 54.99,34.65 58.7,38.36 61.7,38.36 v1(62.1,37.95)
ONEWIRE: length 14
  Top Layer w0.254: U20.4 39.37,69.95 43.05,69.95 43.49,70.4 D6.3 D6.4 43.49,74.71 44.92,76.14 CN5.2
PDAT: length 38.9
  Top Layer w0.254: U22.13 38.26,36.17 v1(33.4,36.17) ; 17.27,58.95 v1(17.27,56.62)
  Inner2 w0.254: v1(17.27,56.62) 17.27,48.75 22.99,43.03 30.61,43.03 33.4,40.24 v1(33.4,36.17)
PSCK: length 40.6
  Top Layer w0.254: U1.11 v1(16,56.62) ; U22.14 38.3,35.41 v1(32.77,35.41)
  Inner2 w0.254: v1(32.77,35.41) 32.77,40.37 30.46,42.67 22.84,42.67 19.69,45.82 19.69,45.83 16.92,48.6 16.92,55.71 v1(16,56.62)
RED: length 12.5
  Top Layer w0.508: CN3.1 12.48,24.9 13.84,26.27 U11.3
RESET: length 71.1
  Top Layer w0.254: C29.1 68.33,62.02 v1(68.33,63.86) ; U22.29 v1(48.64,37.08) ; D8.6 52.15,21.69 R35.1 45.59,24.23 H2.5
  Inner2 w0.254: v1(48.64,37.08) 49.11,37.08 49.66,37.64 49.66,39.13 49.35,39.44 49.35,55.69 58.84,65.18 67.01,65.18 v1(68.33,63.86)
  Bottom Layer w0.254: v1(48.64,37.08) 45.74,37.08 44.32,35.66 44.32,25.76 H2.5
RETURN: length 14.7
  Top Layer w0.508: CN3.5 7.75,45.41 7.75,57.28 SW1.5
RX: length 55
  Top Layer w0.254: U23.2 v1(76.96,67.92) ; U22.30 v1(49.08,37.88)
  Inner2 w0.254: v1(76.96,67.92) 76.96,67.8 76.33,67.16 69.21,67.16 67.58,65.53 58.69,65.53 49,55.84 49,39.22 49.23,38.99 49.23,38.03 v1(49.08,37.88)
SCK: length 13.1
  Top Layer w0.254: H2.3 41.78,25.76 39.75,25.76 39.24,26.27 39.24,27.52 LED1.2 37.46,31.11 38.67,32.31 U22.17
SCL: length 23.2
  Top Layer w0.254: U22.28 v1(49.28,36.28)
  Inner2 w0.254: H1.4 49,16.42 49,34.75 49.28,35.03 v1(49.28,36.28)
SDA: length 22.5
  Top Layer w0.254: U22.27 v1(48.64,35.48)
  Inner2 w0.254: H1.3 48.64,18.6 v1(48.64,35.48)
SHIELD: length 73.4
  Top Layer w1.016: CN1.11 87.2,36.99 87.25,37.03 ; 87.25,37.03 87.25,49.66 ; 87.25,37.03 87.25,15.8 CN1.10 ; 87.25,49.66 87.25,70.77 CN2.11 ; 87.25,49.66 87.17,49.58 CN2.10
SOURCE: length 110.5
  Top Layer w0.508: U11.4 14.1,23.73 12.83,22.46 5.21,22.46 4.19,23.47 4.19,27.51 ; 4.19,27.51 4.22,27.54 12.83,27.54 14.1,28.81 U12.4 ; 4.19,27.51 4.19,32.33 ; 4.19,32.33 4.19,37.54 ; 4.19,32.33 4.22,32.36 12.83,32.36 14.35,33.89 U13.4 ; 4.19,37.54 4.19,41 5.72,42.52 8.51,42.52 10.29,44.3 10.29,58.78 8.25,60.81 5.69,60.81 SW1.2 ; 4.19,37.54 4.29,37.44 12.83,37.44 14.35,38.97 U14.4
STARTIN+: length 24.3
  Top Layer w0.254: v1(62.48,29.31) 60.33,27.16 D3.1
  Bottom Layer w0.254: v1(62.48,29.31) 63.4,30.23 77.19,30.23 80.21,27.21 CN1.4
STARTIN-: length 25.8
  Top Layer w0.254: R11.2 57.55,28.81 v1(59.05,28.81)
  Bottom Layer w0.254: v1(59.05,28.81) 60.71,28.81 62.48,30.58 77.34,30.58 77.95,29.98 CN1.5
STARTOUT+: length 41.3
  Top Layer w0.254: U8.3 60.07,56.75 v1(58.67,56.75)
  Bottom Layer w0.254: v1(58.67,56.75) 61.08,56.75 65.3,60.96 78.18,60.96 80.7,63.48 82.68,63.48 83.95,64.75 85.6,64.75 86.36,63.99 86.36,60.05 85.57,59.26 CN2.4
STARTOUT-: length 34.4
  Top Layer w0.254: v1(67.69,52.94) 71.5,52.94 72.77,51.67 72.77,50.9 73.28,50.4 v1(76.33,50.4) ; CN2.5 81.82,56.29 ; v1(67.18,55.48) 65.41,55.48 64.64,54.71 58.04,54.71 57.53,55.22 U8.4
  Bottom Layer w0.254: v1(76.33,50.4) 78.11,50.4 82.02,54.31 CN2.5 ; v1(67.69,52.94) 67.18,53.44 v1(67.18,55.48)
STARTREAD: length 20.4
  Top Layer w0.254: R13.2 57.78,44.05 R12.2 U7.4 57.53,41.25 v1(56.26,41.25) ; U22.2 44.75,42.06 44.96,42.27 v1(46.36,42.27)
  Inner1 w0.254: v1(56.26,41.25) 55.2,40.19 51.23,40.19 50.82,40.59 48.03,40.59 v1(46.36,42.27)
TX: length 52.7
  Top Layer w0.254: U22.31 v1(48.64,38.68) ; U23.3 v1(75.69,67.92)
  Inner2 w0.254: v1(75.69,67.92) 75.29,67.52 69.06,67.52 67.44,65.89 58.55,65.89 48.64,55.98 v1(48.64,38.68)
VE+: length 22.9
  Top Layer w0.254: U2.2 22.99,83.92 22.99,74.01 22.59,73.61 15.98,73.61 13.34,70.97 R4.2
VE-: length 12.1
  Top Layer w0.254: U2.5 24.26,74.78 22.73,73.26 16.13,73.26 14.86,71.99 R3.2
VEXT: length 76.9
  Top Layer w0.254: v1(63.12,53.95) D2.2 ; v1(60.33,29.57) D3.2 ; D4.2 72.77,32.53 v1(72.77,33.63) ; F1.1 v1(70.23,59.29) ; D1.2 74.7,51.92 v1(76.2,51.92)
  Bottom Layer w0.254: v1(60.33,29.57) 63.12,32.36 v1(63.12,53.95) 68.45,59.29 v1(70.23,59.29) 73.28,59.29 74.55,58.02 74.55,53.51 76.14,51.92 v1(76.2,51.92) 75.06,50.78 75.06,45.57 76.2,44.43 76.2,37.06 v1(72.77,33.63)
VLED: length 31.6
  Top Layer w0.508: F2.2 15.29,75.21 7.75,67.67 7.75,64.27 SW1.6 4.41,64.62 2.92,64.62 1.91,63.6 1.91,56.53 SW1.1
VUSB: length 11
  Top Layer w0.254: 69.14,73.51 v1(67.69,73.51) ; CN4.1 72.52,76.51 D9.5 v1(72.52,73.51)
  Bottom Layer w0.254: v1(67.69,73.51) v1(72.52,73.51)
XTAL+: length 7.1
  Top Layer w0.254: 40.91,47.35 40.91,45.58 X1.1 40.21,44.08 40.21,42.78 40.75,42.24 U22.7
XTAL-: length 5
  Top Layer w0.254: U22.8 39.95,41.51 39.11,42.35 X1.3 37.08,43.43 C24.2
YELLOW: length 12.5
  Top Layer w0.508: U12.3 13.84,31.35 12.45,29.95 7.27,29.95 7.24,29.98
$2N607: length 2.6
  Top Layer w0.254: 21.08,64.44 21.08,66.72 Q1.1
$2N993: length 4.6
  Top Layer w0.254: R4.1 13.34,67.22 C7.1 13.46,67.1 U1.8
$2N998: length 4.6
  Top Layer w0.254: U1.7 14.73,67.1 C7.2 14.86,67.22 R3.1
$2N1066: length 5.7
  Top Layer w0.254: U1.6 16,63.98 15.5,63.48 11.49,63.48 11.3,63.67
$2N1160: length 4.3
  Top Layer w0.254: R2.2 16.53,68.17 R1.1 18.54,66.15 U1.4
$2N1353: length 8.9
  Top Layer w0.254: L1.2 18.03,71.54 R1.2 18.53,67.67 Q1.3 19.81,67.67 19.81,64.44
$3N469: length 3.8
  Top Layer w0.254: R5.1 U3.1
$3N884: length 3.8
  Top Layer w0.254: R8.1 U5.1
$3N1152: length 4.2
  Top Layer w0.254: R11.1 57.53,31.33 U7.1
$3N1252: length 4.2
  Top Layer w0.254: R14.1 68.96,31.33 U9.1
$3N2257: length 4.8
  Top Layer w0.254: R15.1 U10.1
$3N2409: length 4.8
  Top Layer w0.254: R12.1 U8.1
$3N2770: length 4.1
  Top Layer w0.254: R9.2 U6.1
$3N3166: length 4
  Top Layer w0.254: 77.46,47.99 77.46,51.8 R6.2
$4N697: length 2.7
  Top Layer w0.254: U11.1 27.54,23.73 R17.1
$4N831: length 2.7
  Top Layer w0.254: R18.1 27.54,28.81 U12.1
$4N944: length 2.7
  Top Layer w0.254: R19.1 27.54,33.89 U13.1
$4N1057: length 2.7
  Top Layer w0.254: U14.1 27.54,38.97 R20.1
$5N1499: length 2
  Top Layer w0.254: R26.1 47.94,57 47.94,57.3
$5N1502: length 1.9
  Top Layer w0.254: R21.1 34,59.46 U15.3
$5N2548: length 14.8
  Top Layer w1.016: 13.37,79.4 5.51,79.4 3.81,77.7 U19.3 U19.4
$5N2550: length 4.1
  Top Layer w0.254: R29.1 C13.2 6.52,74.59 U19.1
$5N2785: length 6.9
  Top Layer w0.508: U21.3 53.38,69.45 C19.2 50.92,69.39 R30.2 50.92,66.3 D7.2
$5N4471: length 5.4
  Top Layer w0.254: 37.32,54.01 37.32,53.3 36.96,52.94 34.16,52.94 33.91,53.19 R27.1
$5N4479: length 1.7
  Top Layer w0.254: U18.3 41.87,59.71 42.04,59.55
$6N849: length 5
  Top Layer w0.254: F3.1 43.13,15.73 H1.2
$6N1472: length 2
  Top Layer w0.254: R36.2 37.46,25.77 LED1.1
$7N484: length 7
  Top Layer w0.508: F4.1 64.26,71.53 U24.3 U24.4
$7N486: length 10.6
  Top Layer w0.254: R37.1 67.44,61.84 67.44,66.14 66.8,66.78 U24.1 66.87,68.64 C32.2
$7N1108: length 2.9
  Top Layer w0.254: C31.2 74.42,71.41 U23.4
$7N1197: length 6.1
  Top Layer w0.254: U23.13 74.42,62.84 73.41,61.83 C29.2

## Copper pours and planes (outline as drawn; the poured copper is in the pictures)
GND on Top Layer: -1.65,90.27 90.55,90.27 90.55,-1.67 -1.65,-1.67
GND on Bottom Layer: -0.89,90.27 90.55,90.27 90.55,-2.18 -0.89,-2.18
GND on Inner1: -1.4,90.02 90.3,90.02 90.3,-1.42 -1.4,-1.42
GND on Inner2: -0.89,89.77 90.04,89.77 90.04,-1.42 -0.89,-1.42

## Text on the board
Bottom Silkscreen Layer: Jim Heaney, RIT SHED Makerspace | Open Source, CERN-OHL-S License | For use with Epilog Lasers, BOFA Extractors | https://github.com/rit-construct-makerspace/laser-monitor | Laser Safety Monitor V1.0.0
Top Silkscreen Layer: - + D C | Andon Light Connection | Laser -> | PNP | MODE | NPN | P | B | G | Y | R | Feb 2026 | Ver 1.0.1 | 5 | I | O | C | Monitor | Safety | Laser
